# EAGLE schematic docusym demo (EAGLE 7.4.0)
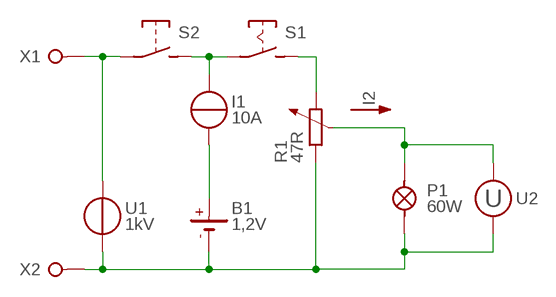
[diagram p0: schematic, sheet 1]
I2 (MESSPFEIL): _EXTERNAL_: 0

## Parts
B1  1,2V  AKKU  (no package)
I1  10A  STROMQUELLE  (no package)
P1  60W  LAMPE  (no package)
R1  47R  POTENTIOMETER  (no package)
S1  SCHALTER  (no package)
S2  TASTER  (no package)
U1  1kV  SPANNUNGSQUELLE  (no package)
U2  MESSGERAET  (no package)
X1  KLEMME  (no package)
X2  KLEMME  (no package)

## Nets
N$1: S2.P U1.P$2 X1.KL
N$2: I1.P$2 S1.P S2.S
N$3: B1.- P1.P$1 R1.A U1.P$1 U2.P$1 X2.KL
N$4: P1.P$2 R1.S U2.P$2
N$5: B1.+ I1.P$1
N$6: R1.B S1.S

## Library data of the parts
B1 = luani_docuSymbol:AKKU: Akku (1 Zelle); _EXTERNAL_: 0
I1 = luani_docuSymbol:STROMQUELLE: Ideale Stromquelle; _EXTERNAL_: 0
P1 = luani_docuSymbol:LAMPE: Lampe; _EXTERNAL_: 0
R1 = luani_docuSymbol:POTENTIOMETER: Potentiometer; _EXTERNAL_: 0
S1 = luani_docuSymbol:SCHALTER: Schalter, 1 Schließer; _EXTERNAL_: 0
S2 = luani_docuSymbol:TASTER: Taster, 1 Schließer; _EXTERNAL_: 0
U1 = luani_docuSymbol:SPANNUNGSQUELLE: Ideale Spannungsquelle; _EXTERNAL_: 0
U2 = luani_docuSymbol:MESSGERAET: Messgerät Bezeichnung: Attribut "Typ"; TYP: U; _EXTERNAL_: 0
X1 X2 = luani_docuSymbol:KLEMME: Klemme; _EXTERNAL_: 0